# EAGLE schematic WaldoRevd (EAGLE 8.3.2)

## Sheet 1 of 6: Microcontroller Module
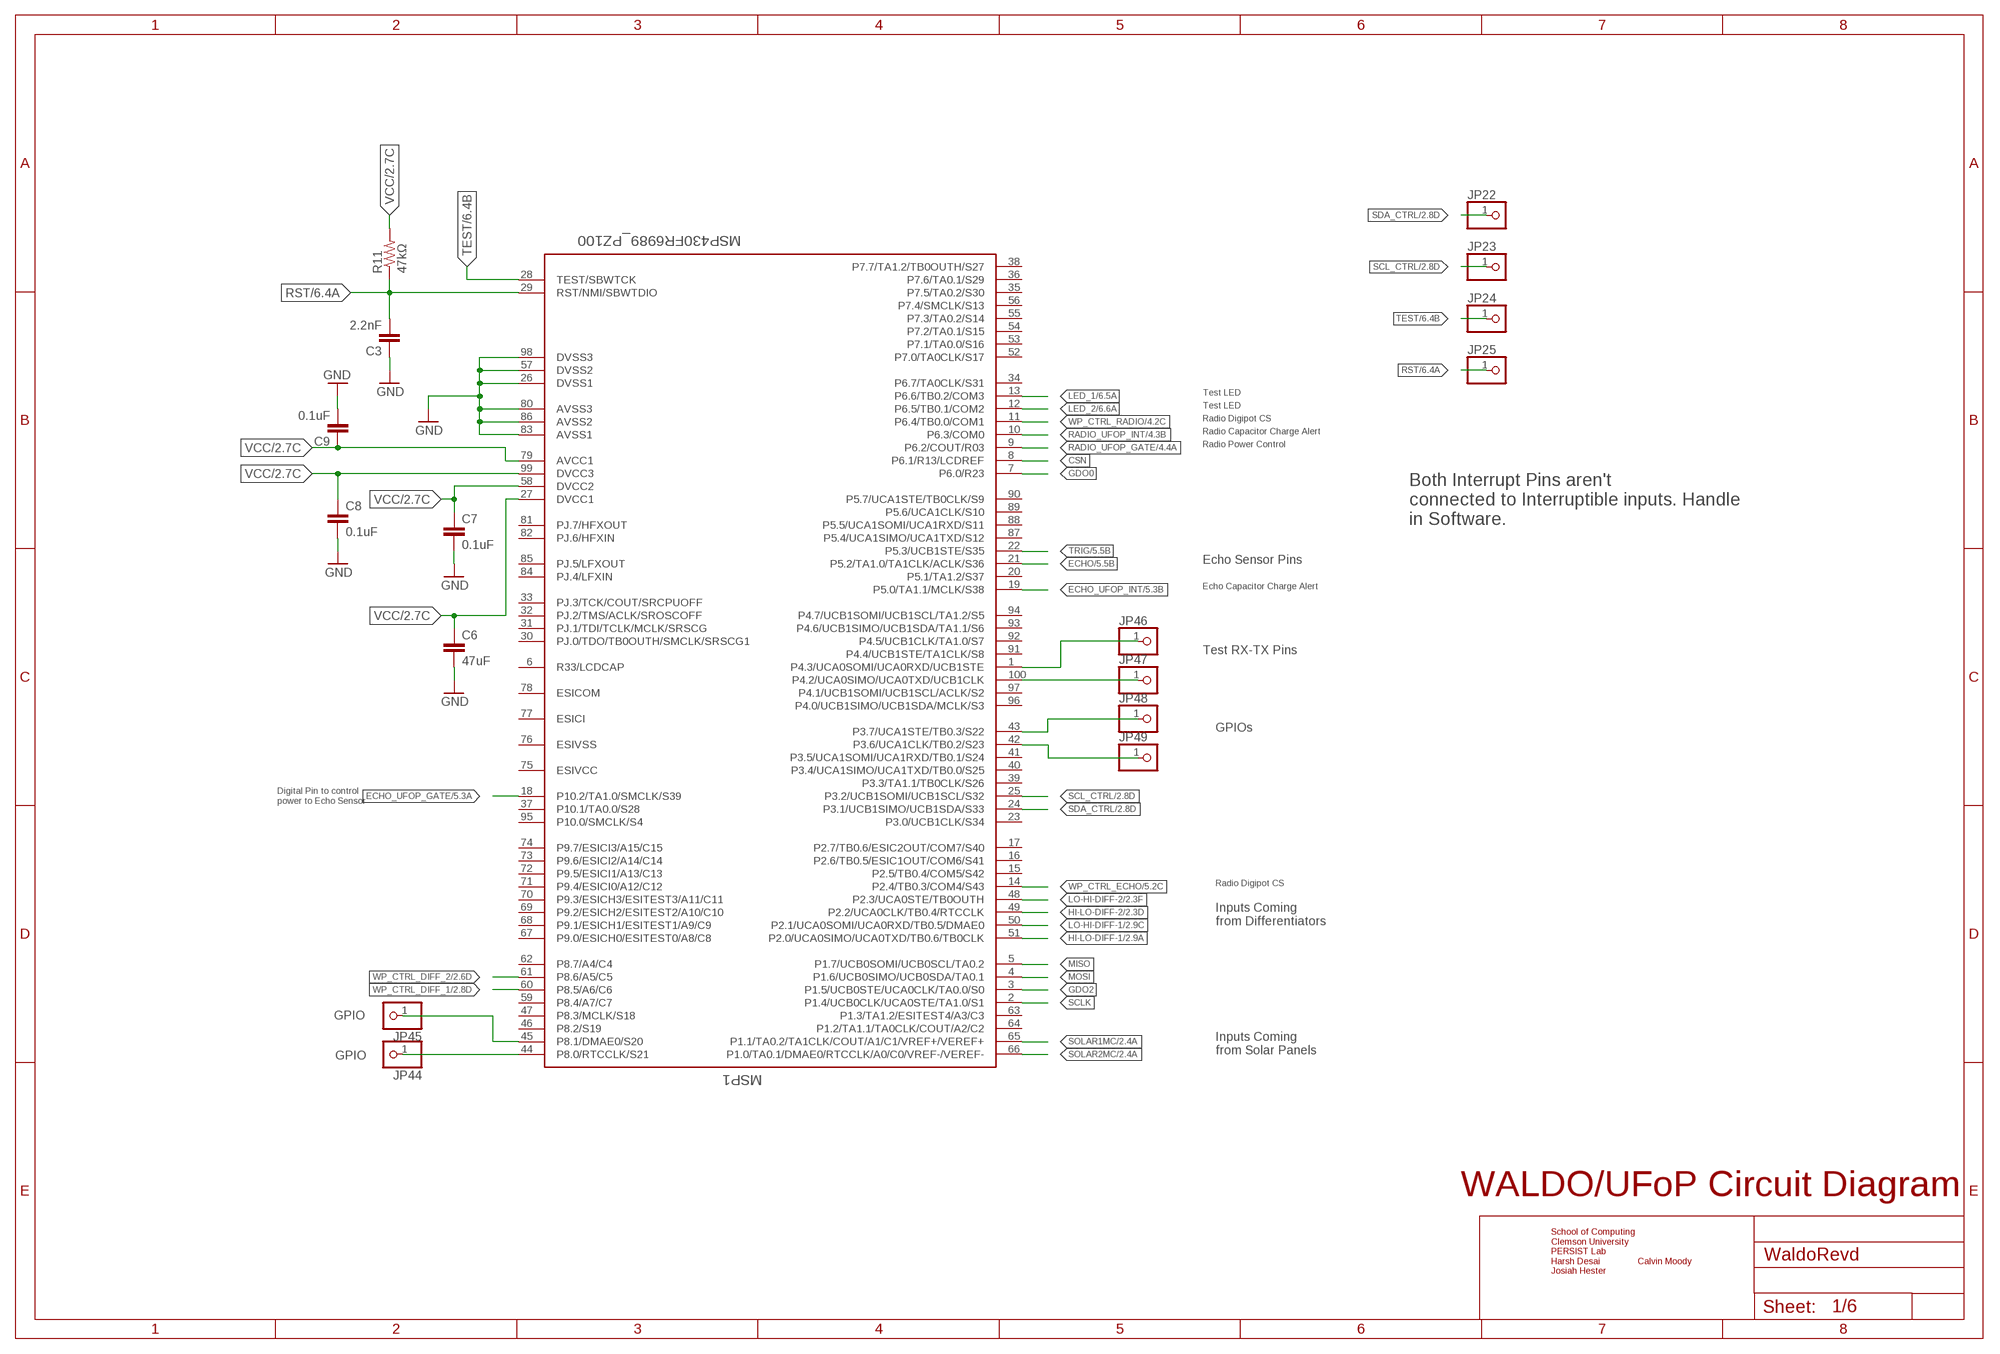
[diagram p0: schematic, sheet 1]

### Parts
C3  2.2nF  CAP0805  [0805]
C6  47uF  CAP0805  [0805]
C7  0.1uF  CAP0805  [0805]
C8  0.1uF  CAP0805  [0805]
C9  0.1uF  CAP0805  [0805]
JP22  PINHD-1X1  [1X01]
JP23  PINHD-1X1  [1X01]
JP24  PINHD-1X1  [1X01]
JP25  PINHD-1X1  [1X01]
JP44  PINHD-1X1  [1X01]
JP45  PINHD-1X1  [1X01]
JP46  PINHD-1X1  [1X01]
JP47  PINHD-1X1  [1X01]
JP48  PINHD-1X1  [1X01]
JP49  PINHD-1X1  [1X01]
MSP1  MSP430FR6989_PZ100  [PZ100]
R11  47kΩ  RESISTOR0805-RES  [0805]

### Nets
CSN: MSP1.8(P6.1/R13/LCDREF) ; also sheet 4
ECHO: MSP1.21(P5.2/TA1.0/TA1CLK/ACLK/S36) ; also sheet 5
ECHO_UFOP_GATE: MSP1.18(P10.2/TA1.0/SMCLK/S39) ; also sheet 5
ECHO_UFOP_INT: MSP1.19(P5.0/TA1.1/MCLK/S38) ; also sheet 5
GDO0: MSP1.7(P6.0/R23) ; also sheet 4
GDO2: MSP1.3(P1.5/UCB0STE/UCA0CLK/TA0.0/S0) ; also sheet 4
GND: C3.1 C6.2 C7.2 C8.2 C9.2 MSP1.26(DVSS1) MSP1.57(DVSS2) MSP1.80(AVSS3) MSP1.83(AVSS1) MSP1.86(AVSS2) MSP1.98(DVSS3) ; also sheet 2,3,4,5,6
HI-LO-DIFF-1: MSP1.51(P2.0/UCA0SIMO/UCA0TXD/TB0.6/TB0CLK) ; also sheet 2
HI-LO-DIFF-2: MSP1.49(P2.2/UCA0CLK/TB0.4/RTCCLK) ; also sheet 2
LED_1: MSP1.13(P6.6/TB0.2/COM3) ; also sheet 6
LED_2: MSP1.12(P6.5/TB0.1/COM2) ; also sheet 6
LO-HI-DIFF-1: MSP1.50(P2.1/UCA0SOMI/UCA0RXD/TB0.5/DMAE0) ; also sheet 2
LO-HI-DIFF-2: MSP1.48(P2.3/UCA0STE/TB0OUTH) ; also sheet 2
MISO: MSP1.5(P1.7/UCB0SOMI/UCB0SCL/TA0.2) ; also sheet 4
MOSI: MSP1.4(P1.6/UCB0SIMO/UCB0SDA/TA0.1) ; also sheet 4
N$1: JP44.1 MSP1.44(P8.0/RTCCLK/S21)
N$2: JP45.1 MSP1.45(P8.1/DMAE0/S20)
N$3: JP46.1 MSP1.1(P4.3/UCA0SOMI/UCA0RXD/UCB1STE)
N$5: JP47.1 MSP1.100(P4.2/UCA0SIMO/UCA0TXD/UCB1CLK)
N$6: JP49.1 MSP1.42(P3.6/UCA1CLK/TB0.2/S23)
N$10: JP48.1 MSP1.43(P3.7/UCA1STE/TB0.3/S22)
RADIO_UFOP_GATE: MSP1.9(P6.2/COUT/R03) ; also sheet 4
RADIO_UFOP_INT: MSP1.10(P6.3/COM0) ; also sheet 4
RST: C3.2 JP25.1 MSP1.29(RST/NMI/SBWTDIO) R11.1 ; also sheet 6
SCL_CTRL: JP23.1 MSP1.25(P3.2/UCB1SOMI/UCB1SCL/S32) ; also sheet 2,4,5,6
SCLK: MSP1.2(P1.4/UCB0CLK/UCA0STE/TA1.0/S1) ; also sheet 4
SDA_CTRL: JP22.1 MSP1.24(P3.1/UCB1SIMO/UCB1SDA/S33) ; also sheet 2,4,5,6
SOLAR1MC: MSP1.65(P1.1/TA0.2/TA1CLK/COUT/A1/C1/VREF+/VEREF+) ; also sheet 2
SOLAR2MC: MSP1.66(P1.0/TA0.1/DMAE0/RTCCLK/A0/C0/VREF-/VEREF-) ; also sheet 2
TEST: JP24.1 MSP1.28(TEST/SBWTCK) ; also sheet 6
TRIG: MSP1.22(P5.3/UCB1STE/S35) ; also sheet 5
VCC: C6.1 C7.1 C8.1 C9.1 MSP1.27(DVCC1) MSP1.58(DVCC2) MSP1.79(AVCC1) MSP1.99(DVCC3) R11.2 ; also sheet 2,3,6
WP_CTRL_DIFF_1: MSP1.60(P8.5/A6/C6) ; also sheet 2
WP_CTRL_DIFF_2: MSP1.61(P8.6/A5/C5) ; also sheet 2
WP_CTRL_ECHO: MSP1.14(P2.4/TB0.3/COM4/S43) ; also sheet 5
WP_CTRL_RADIO: MSP1.11(P6.4/TB0.0/COM1) ; also sheet 4
Unconnected: MSP1.6(R33/LCDCAP) MSP1.15(P2.5/TB0.4/COM5/S42) MSP1.16(P2.6/TB0.5/ESIC1OUT/COM6/S41) MSP1.17(P2.7/TB0.6/ESIC2OUT/COM7/S40) MSP1.20(P5.1/TA1.2/S37) MSP1.23(P3.0/UCB1CLK/S34) MSP1.30(PJ.0/TDO/TB0OUTH/SMCLK/SRSCG1) MSP1.31(PJ.1/TDI/TCLK/MCLK/SRSCG) MSP1.32(PJ.2/TMS/ACLK/SROSCOFF) MSP1.33(PJ.3/TCK/COUT/SRCPUOFF) MSP1.34(P6.7/TA0CLK/S31) MSP1.35(P7.5/TA0.2/S30) MSP1.36(P7.6/TA0.1/S29) MSP1.37(P10.1/TA0.0/S28) MSP1.38(P7.7/TA1.2/TB0OUTH/S27) MSP1.39(P3.3/TA1.1/TB0CLK/S26) MSP1.40(P3.4/UCA1SIMO/UCA1TXD/TB0.0/S25) MSP1.41(P3.5/UCA1SOMI/UCA1RXD/TB0.1/S24) MSP1.46(P8.2/S19) MSP1.47(P8.3/MCLK/S18) MSP1.52(P7.0/TA0CLK/S17) MSP1.53(P7.1/TA0.0/S16) MSP1.54(P7.2/TA0.1/S15) MSP1.55(P7.3/TA0.2/S14) MSP1.56(P7.4/SMCLK/S13) MSP1.59(P8.4/A7/C7) MSP1.62(P8.7/A4/C4) MSP1.63(P1.3/TA1.2/ESITEST4/A3/C3) MSP1.64(P1.2/TA1.1/TA0CLK/COUT/A2/C2) MSP1.67(P9.0/ESICH0/ESITEST0/A8/C8) MSP1.68(P9.1/ESICH1/ESITEST1/A9/C9) MSP1.69(P9.2/ESICH2/ESITEST2/A10/C10) MSP1.70(P9.3/ESICH3/ESITEST3/A11/C11) MSP1.71(P9.4/ESICI0/A12/C12) MSP1.72(P9.5/ESICI1/A13/C13) MSP1.73(P9.6/ESICI2/A14/C14) MSP1.74(P9.7/ESICI3/A15/C15) MSP1.75(ESIVCC) MSP1.76(ESIVSS) MSP1.77(ESICI) MSP1.78(ESICOM) MSP1.81(PJ.7/HFXOUT) MSP1.82(PJ.6/HFXIN) MSP1.84(PJ.4/LFXIN) MSP1.85(PJ.5/LFXOUT) MSP1.87(P5.4/UCA1SIMO/UCA1TXD/S12) MSP1.88(P5.5/UCA1SOMI/UCA1RXD/S11) MSP1.89(P5.6/UCA1CLK/S10) MSP1.90(P5.7/UCA1STE/TB0CLK/S9) MSP1.91(P4.4/UCB1STE/TA1CLK/S8) MSP1.92(P4.5/UCB1CLK/TA1.0/S7) MSP1.93(P4.6/UCB1SIMO/UCB1SDA/TA1.1/S6) MSP1.94(P4.7/UCB1SOMI/UCB1SCL/TA1.2/S5) MSP1.95(P10.0/SMCLK/S4) MSP1.96(P4.0/UCB1SIMO/UCB1SDA/MCLK/S3) MSP1.97(P4.1/UCB1SOMI/UCB1SCL/ACLK/S2)

### Notes on the sheet
- Test LED
- Test LED
- Radio Digipot CS
- Radio Capacitor Charge Alert
- Radio Power Control
- Both Interrupt Pins aren't 
  connected to Interruptible inputs. Handle
  in Software.
- Echo Sensor Pins
- Echo Capacitor Charge Alert
- Test RX-TX Pins
- GPIOs
- Digital Pin to control 
  power to Echo Sensor
- Radio Digipot CS
- Inputs Coming 
  from Differentiators
- GPIO
- Inputs Coming 
  from Solar Panels
- GPIO
- WALDO/UFoP Circuit Diagram
- School of Computing
  Clemson University
  PERSIST Lab
  Harsh Desai               Calvin Moody
  Josiah Hester

## Sheet 2 of 6: Solar Panels + Processing (Differentiators)
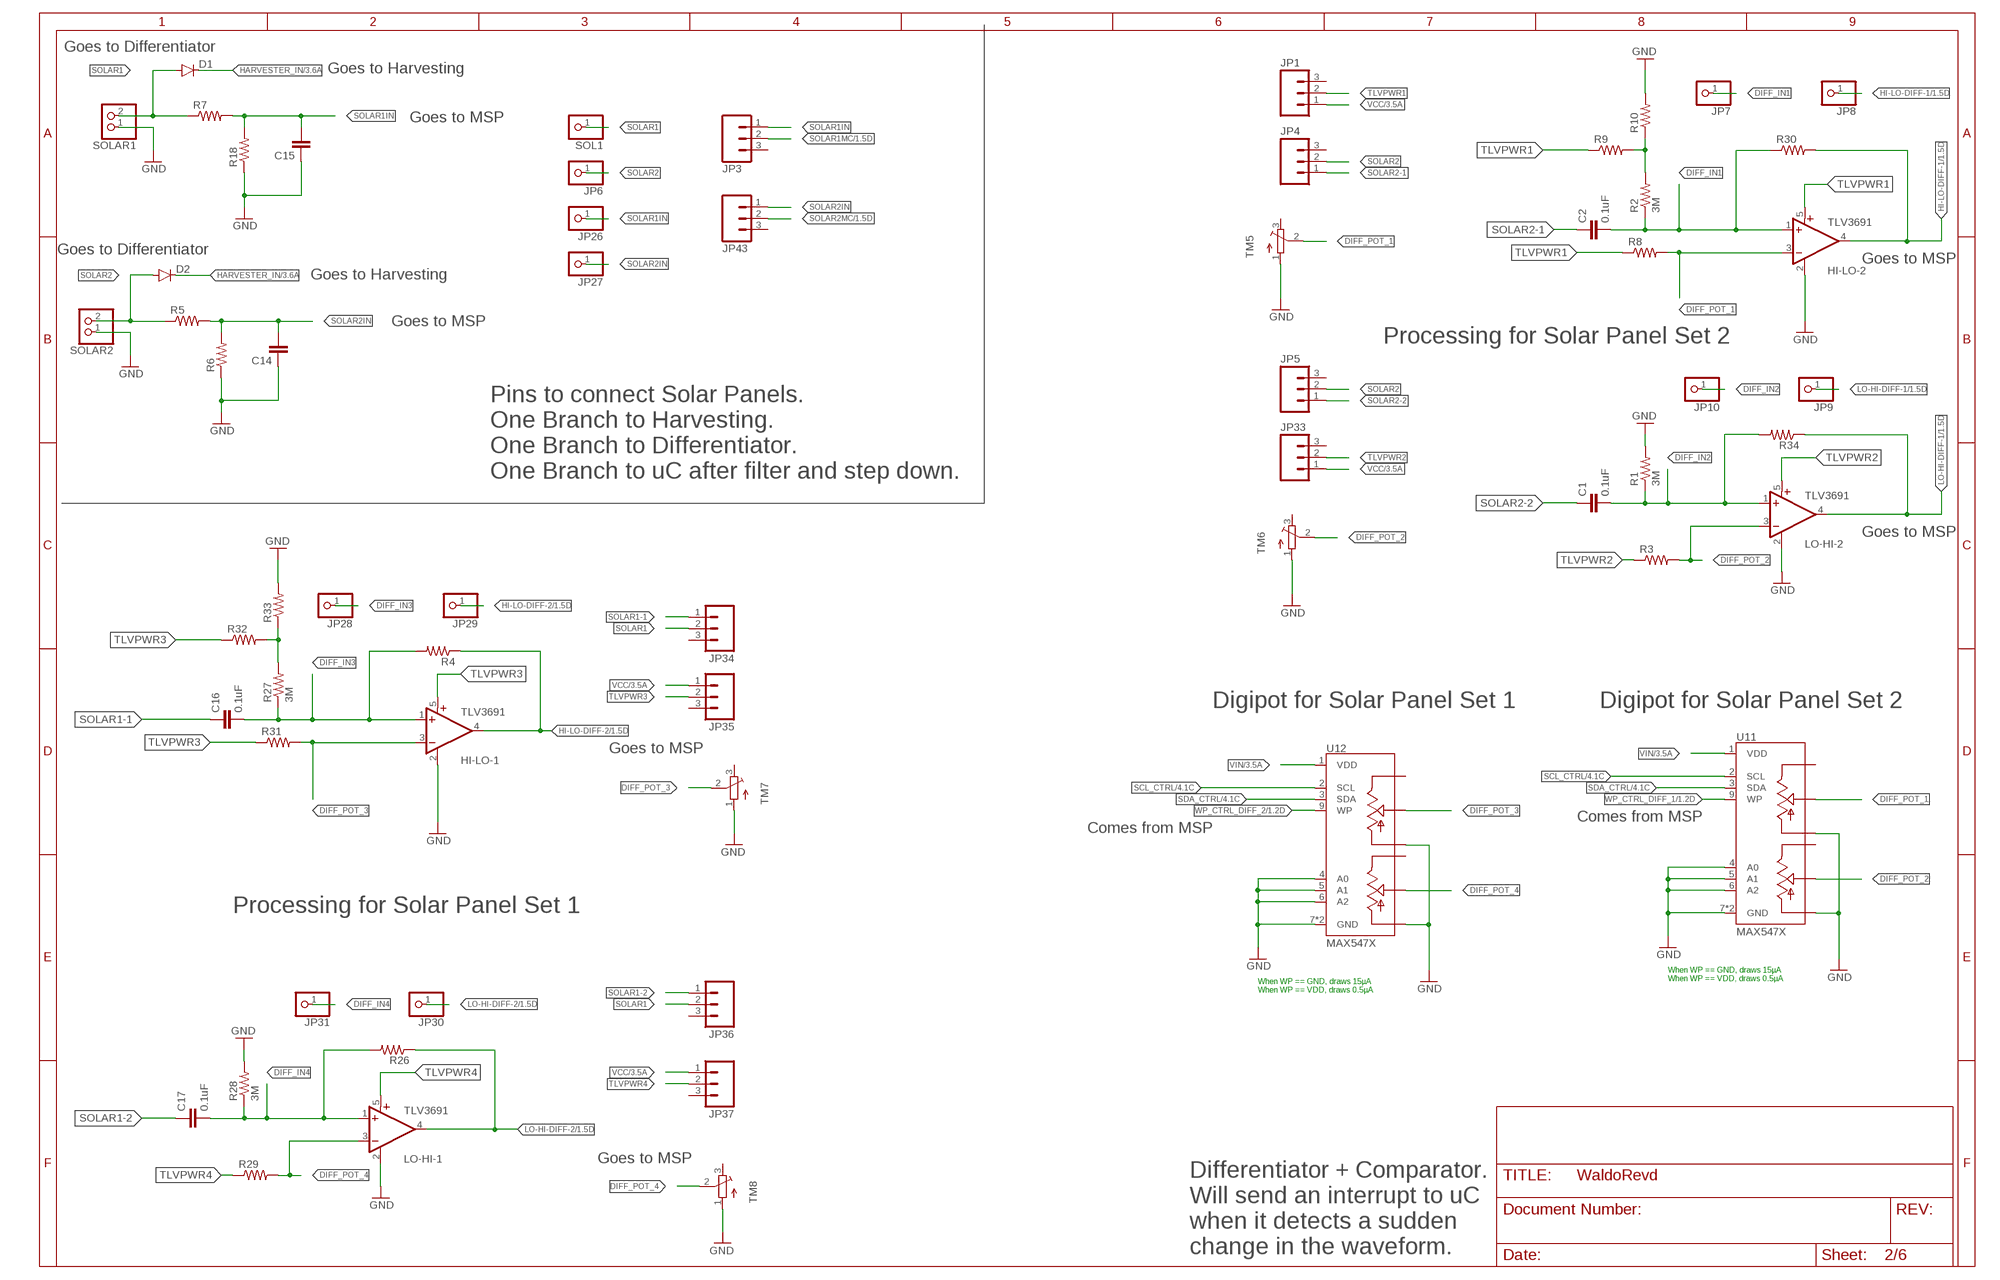
[diagram p1: schematic, sheet 2]

### Parts
C1  0.1uF  CAP0805  [0805]
C2  0.1uF  CAP0805  [0805]
C14  CAP0805  [0805]
C15  CAP0805  [0805]
C16  0.1uF  CAP0805  [0805]
C17  0.1uF  CAP0805  [0805]
D1  DIODESOD523  [SOD523]
D2  DIODESOD523  [SOD523]
HI-LO-1  TLV3691  [SC70-5]
HI-LO-2  TLV3691  [SC70-5]
JP1  M03  [1X03-1.27MM]
JP3  M03  [1X03-1.27MM]
JP4  M03  [1X03-1.27MM]
JP5  M03  [1X03-1.27MM]
JP6  PINHD-1X1  [1X01]
JP7  PINHD-1X1  [1X01]
JP8  PINHD-1X1  [1X01]
JP9  PINHD-1X1  [1X01]
JP10  PINHD-1X1  [1X01]
JP26  PINHD-1X1  [1X01]
JP27  PINHD-1X1  [1X01]
JP28  PINHD-1X1  [1X01]
JP29  PINHD-1X1  [1X01]
JP30  PINHD-1X1  [1X01]
JP31  PINHD-1X1  [1X01]
JP33  M03  [1X03-1.27MM]
JP34  M03  [1X03-1.27MM]
JP35  M03  [1X03-1.27MM]
JP36  M03  [1X03-1.27MM]
JP37  M03  [1X03-1.27MM]
JP43  M03  [1X03-1.27MM]
LO-HI-1  TLV3691  [SC70-5]
LO-HI-2  TLV3691  [SC70-5]
R1  3M  RESISTOR0805-RES  [0805]
R2  3M  RESISTOR0805-RES  [0805]
R3  RESISTOR0805-RES  [0805]
R4  RESISTOR0805-RES  [0805]
R5  RESISTOR0805-RES  [0805]
R6  RESISTOR0805-RES  [0805]
R7  RESISTOR0805-RES  [0805]
R8  RESISTOR0805-RES  [0805]
R9  RESISTOR0805-RES  [0805]
R10  RESISTOR0805-RES  [0805]
R18  RESISTOR0805-RES  [0805]
R26  RESISTOR0805-RES  [0805]
R27  3M  RESISTOR0805-RES  [0805]
R28  3M  RESISTOR0805-RES  [0805]
R29  RESISTOR0805-RES  [0805]
R30  RESISTOR0805-RES  [0805]
R31  RESISTOR0805-RES  [0805]
R32  RESISTOR0805-RES  [0805]
R33  RESISTOR0805-RES  [0805]
R34  RESISTOR0805-RES  [0805]
SOL1  PINHD-1X1  [1X01]
SOLAR1  PINHD-1X2  [1X02]
SOLAR2  PINHD-1X2  [1X02]
TM5  TRIMPOTTC33X  [TC33X]
TM6  TRIMPOTTC33X  [TC33X]
TM7  TRIMPOTTC33X  [TC33X]
TM8  TRIMPOTTC33X  [TC33X]
U11  MAX547X  [QFN16]
U12  MAX547X  [QFN16]

### Nets
DIFF_IN1: C2.2 HI-LO-2.1(+IN) JP7.1 R2.1 R30.1
DIFF_IN2: C1.2 JP10.1 LO-HI-2.1(+IN) R1.1 R34.2
DIFF_IN3: C16.2 HI-LO-1.1(+IN) JP28.1 R4.2 R27.1
DIFF_IN4: C17.2 JP31.1 LO-HI-1.1(+IN) R26.2 R28.1
DIFF_POT_1: HI-LO-2.3(-IN) R8.2 TM5.2(S) U11.14(WA)
DIFF_POT_2: LO-HI-2.3(-IN) R3.2 TM6.2(S) U11.11(WB)
DIFF_POT_3: HI-LO-1.3(-IN) R31.2 TM7.2(S) U12.14(WA)
DIFF_POT_4: LO-HI-1.3(-IN) R29.2 TM8.2(S) U12.11(WB)
GND: C14.1 C15.1 HI-LO-1.2(GND) HI-LO-2.2(GND) LO-HI-1.2(GND) LO-HI-2.2(GND) R1.2 R6.1 R10.2 R18.1 R28.2 R33.2 SOLAR1.1 SOLAR2.1 TM5.1(A) TM6.1(A) TM7.1(A) TM8.1(A) U11.4(A0) U11.5(A1) U11.6(A2) U11.7(GND) U11.10(LB) U11.13(LA) U11.TH(GND) U12.4(A0) U12.5(A1) U12.6(A2) U12.7(GND) U12.10(LB) U12.13(LA) U12.TH(GND) ; also sheet 1,3,4,5,6
HARVESTER_IN: D1.C D2.C ; also sheet 3
HI-LO-DIFF-1: HI-LO-2.4(OUT) JP8.1 R30.2 ; also sheet 1
HI-LO-DIFF-2: HI-LO-1.4(OUT) JP29.1 R4.1 ; also sheet 1
LO-HI-DIFF-1: JP9.1 LO-HI-2.4(OUT) R34.1 ; also sheet 1
LO-HI-DIFF-2: JP30.1 LO-HI-1.4(OUT) R26.1 ; also sheet 1
N$4: R27.2 R32.2 R33.1
N$8: R2.2 R9.2 R10.1
SCL_CTRL: U11.2(SCL) U12.2(SCL) ; also sheet 1,4,5,6
SDA_CTRL: U11.3(SDA) U12.3(SDA) ; also sheet 1,4,5,6
SOLAR1: D1.A JP34.2 JP36.2 R7.1 SOL1.1 SOLAR1.2
SOLAR1-1: C16.1 JP34.1
SOLAR1-2: C17.1 JP36.1
SOLAR1IN: C15.2 JP3.1 JP26.1 R7.2 R18.2
SOLAR1MC: JP3.2 ; also sheet 1
SOLAR2: D2.A JP4.2 JP5.2 JP6.1 R5.1 SOLAR2.2
SOLAR2-1: C2.1 JP4.1
SOLAR2-2: C1.1 JP5.1
SOLAR2IN: C14.2 JP27.1 JP43.1 R5.2 R6.2
SOLAR2MC: JP43.2 ; also sheet 1
TLVPWR1: HI-LO-2.5(V+) JP1.2 R8.1 R9.1
TLVPWR2: JP33.2 LO-HI-2.5(V+) R3.1
TLVPWR3: HI-LO-1.5(V+) JP35.2 R31.1 R32.1
TLVPWR4: JP37.2 LO-HI-1.5(V+) R29.1
VCC: JP1.1 JP33.1 JP35.1 JP37.1 ; also sheet 1,3,6
VIN: U11.1(VDD) U12.1(VDD) ; also sheet 3,4,5,6
WP_CTRL_DIFF_1: U11.9(WP) ; also sheet 1
WP_CTRL_DIFF_2: U12.9(WP) ; also sheet 1
Unconnected: JP1.3 JP3.3 JP4.3 JP5.3 JP33.3 JP34.3 JP35.3 JP36.3 JP37.3 JP43.3 TM5.3(E) TM6.3(E) TM7.3(E) TM8.3(E) U11.12(HB) U11.15(HA) U12.12(HB) U12.15(HA)

### Notes on the sheet
- Goes to Differentiator
- Goes to Harvesting
- Goes to MSP
- Goes to Differentiator
- Goes to MSP
- Goes to Harvesting
- Goes to MSP
- Processing for Solar Panel Set 2
- Pins to connect Solar Panels.
  One Branch to Harvesting.
  One Branch to Differentiator.
  One Branch to uC after filter and step down.
- Goes to MSP
- Digipot for Solar Panel Set 1 | Digipot for Solar Panel Set 2
- Goes to MSP
- Comes from MSP
- Comes from MSP
- Processing for Solar Panel Set 1
- When WP == GND, draws 15µA
  When WP == VDD, draws 0.5µA
- When WP == GND, draws 15µA
  When WP == VDD, draws 0.5µA
- Goes to MSP
- Differentiator + Comparator.
  Will send an interrupt to uC 
  when it detects a sudden 
  change in the waveform.

## Sheet 3 of 6: Battery + Regulator
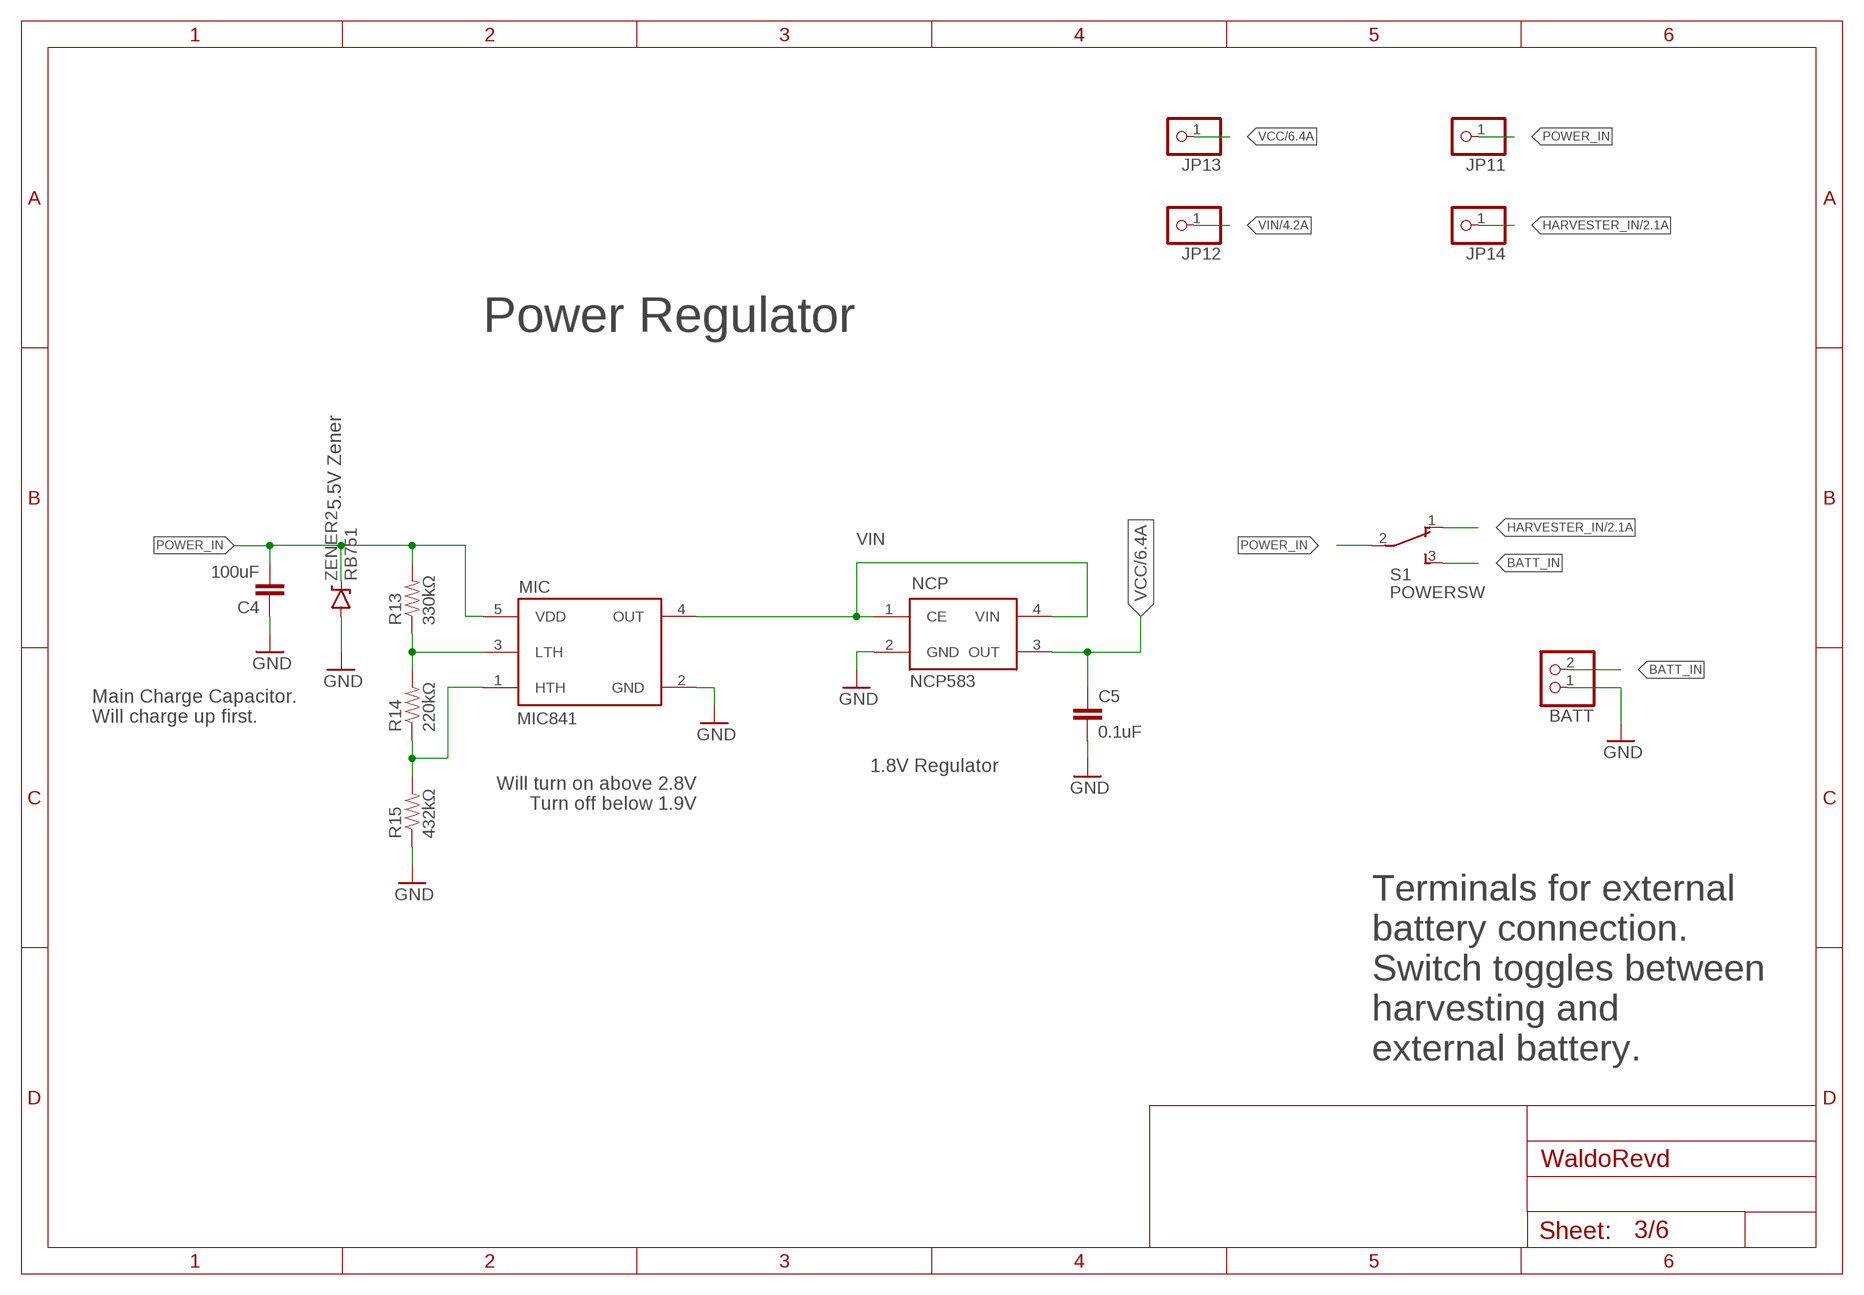
[diagram p2: schematic, sheet 3]

### Parts
BATT  PINHD-1X2  [1X02]
C4  100uF  CAP0805  [0805]
C5  0.1uF  CAP0805  [0805]
JP11  PINHD-1X1  [1X01]
JP12  PINHD-1X1  [1X01]
JP13  PINHD-1X1  [1X01]
JP14  PINHD-1X1  [1X01]
MIC  MIC841  [SC70-5]
NCP  NCP583  [SC82-AB_1PRIMARY]
R13  330kΩ  RESISTOR0805-RES  [0805]
R14  220kΩ  RESISTOR0805-RES  [0805]
R15  432kΩ  RESISTOR0805-RES  [0805]
S1  POWERSW  [TL3XYO]
ZENER2  RB751  DIODE-ZENER  [SOD-523]

### Nets
BATT_IN: BATT.2 S1.3(S)
GND: BATT.1 C4.1 C5.2 MIC.2(GND) NCP.2(GND) R15.1 ZENER2.ANODE(A) ; also sheet 1,2,4,5,6
HARVESTER_IN: JP14.1 S1.1(O) ; also sheet 2
N$11: MIC.3(LTH) R13.1 R14.2
N$12: MIC.1(HTH) R14.1 R15.2
POWER_IN: C4.2 JP11.1 MIC.5(VDD) R13.2 S1.2(P) ZENER2.CATHODE(C)
VCC: C5.1 JP13.1 NCP.3(OUT) ; also sheet 1,2,6
VIN: JP12.1 MIC.4(OUT) NCP.1(CE) NCP.4(VIN) ; also sheet 2,4,5,6

### Notes on the sheet
- Power Regulator
- 5.5V Zener
- Main Charge Capacitor.
  Will charge up first.
- 1.8V Regulator
- Will turn on above 2.8V
  Turn off below 1.9V
- Terminals for external
  battery connection.
  Switch toggles between
  harvesting and 
  external battery.

## Sheet 4 of 6: Radio Module
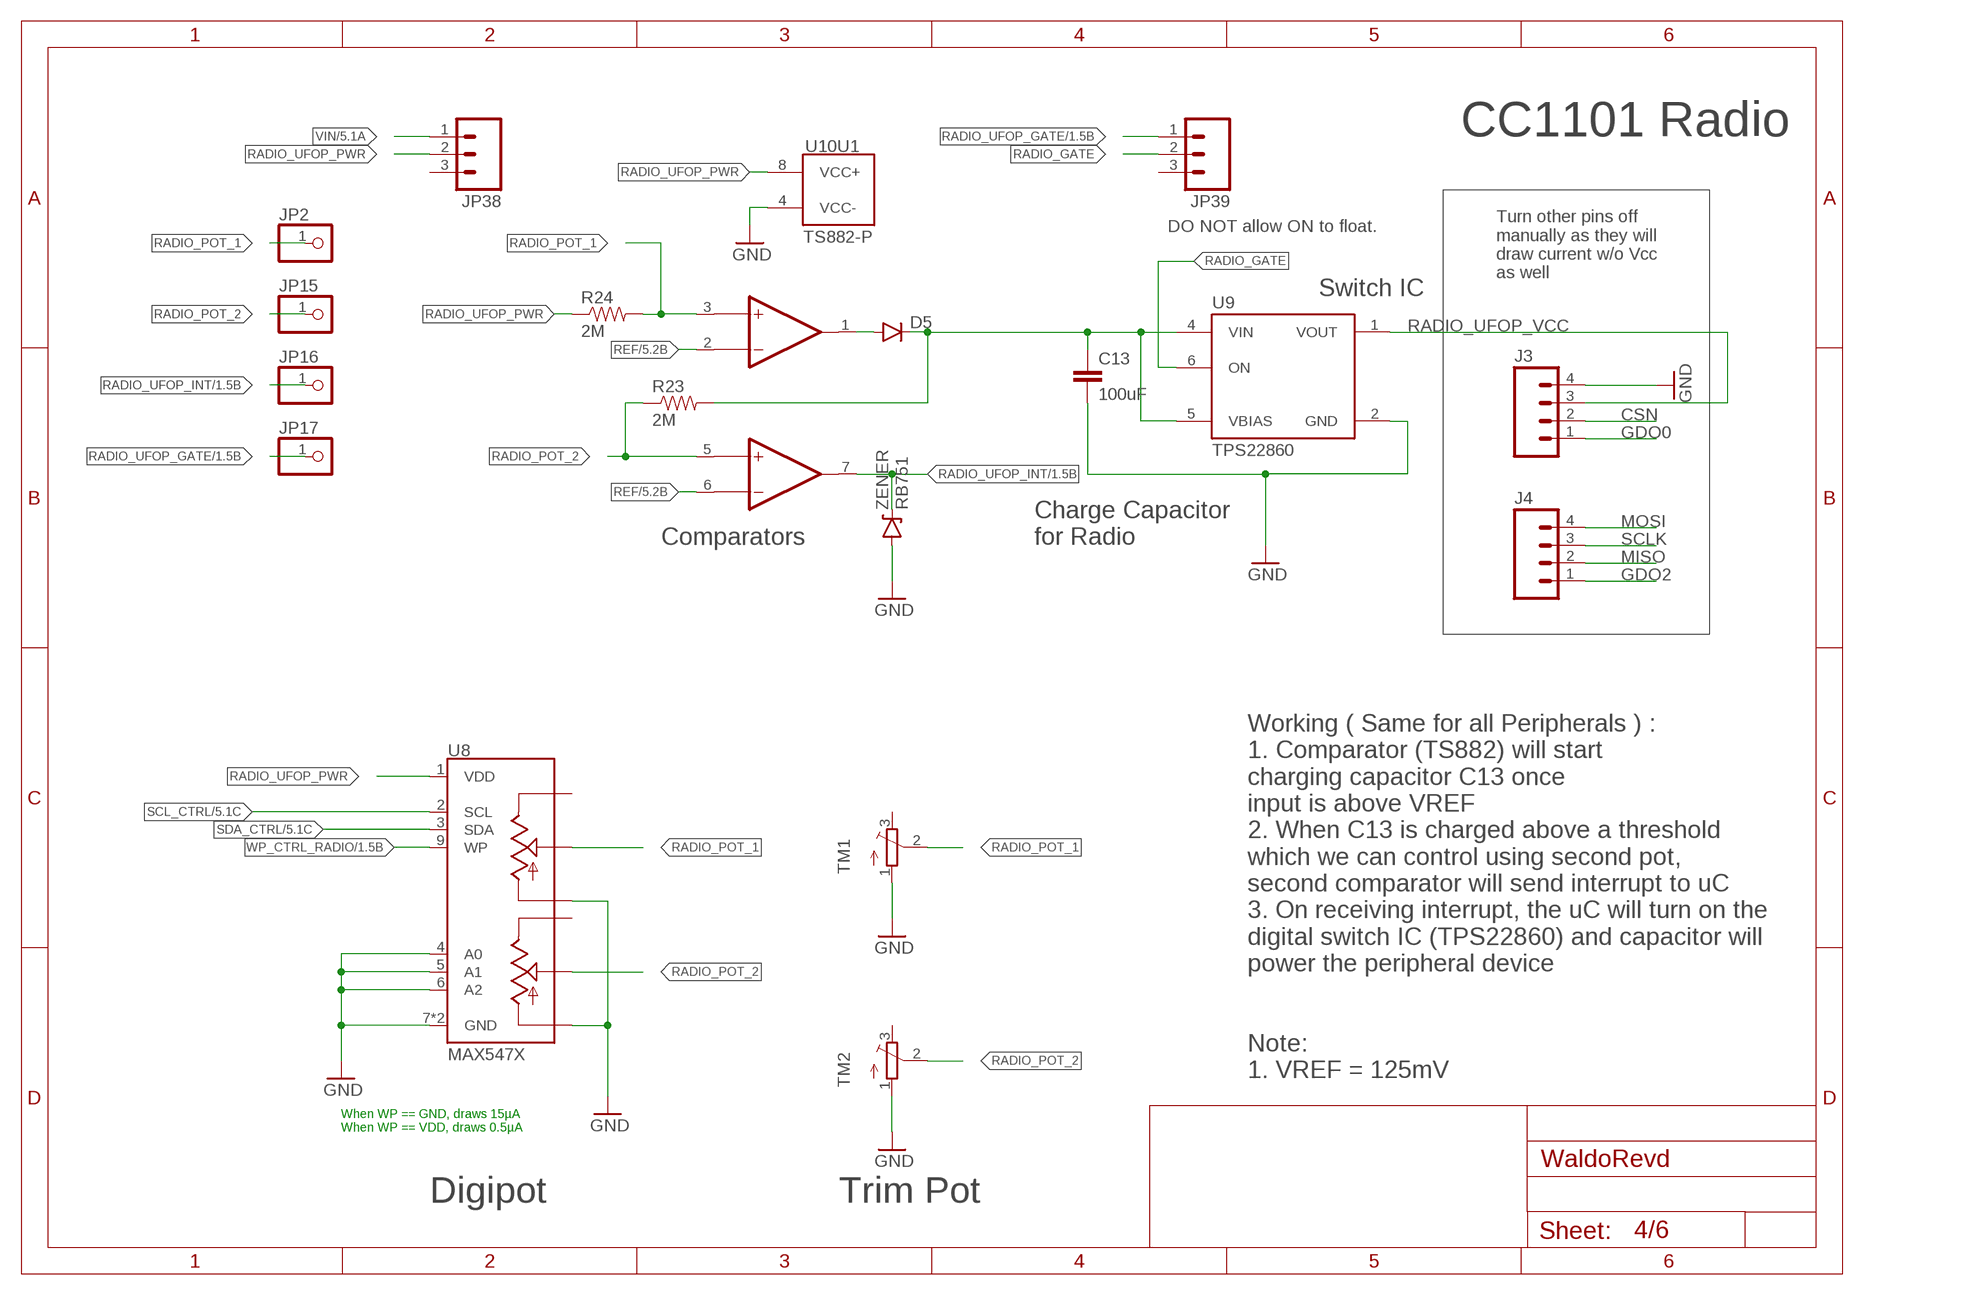
[diagram p3: schematic, sheet 4]

### Parts
C13  100uF  CAP0805  [0805]
D5  DIODESOD523  [SOD523]
J3  M04PTH  [1X04]
J4  M04PTH  [1X04]
JP2  PINHD-1X1  [1X01]
JP15  PINHD-1X1  [1X01]
JP16  PINHD-1X1  [1X01]
JP17  PINHD-1X1  [1X01]
JP38  M03  [1X03-1.27MM]
JP39  M03  [1X03-1.27MM]
R23  2M  RESISTOR0805-RES  [0805]
R24  2M  RESISTOR0805-RES  [0805]
TM1  TRIMPOTTC33X  [TC33X]
TM2  TRIMPOTTC33X  [TC33X]
U8  MAX547X  [QFN16]
U9  TPS22860  [TSOT23-6]
U10  TS882-P  [UDFN8]
ZENER  RB751  DIODE-ZENER  [SOD-523]

### Nets
CSN: J3.2 ; also sheet 1
GDO0: J3.1 ; also sheet 1
GDO2: J4.1 ; also sheet 1
GND: C13.2 J3.4 TM1.1(A) TM2.1(A) U8.4(A0) U8.5(A1) U8.6(A2) U8.7(GND) U8.10(LB) U8.13(LA) U8.TH(GND) U9.2(GND) U10.4(U1:VCC-) ZENER.ANODE(A) ; also sheet 1,2,3,5,6
MISO: J4.2 ; also sheet 1
MOSI: J4.4 ; also sheet 1
N$22: C13.1 D5.C R23.2 U9.4(VIN) U9.5(VBIAS)
N$24: D5.A U10.1(OP1:OUT1)
RADIO_GATE: JP39.2 U9.6(ON)
RADIO_POT_1: JP2.1 R24.2 TM1.2(S) U8.14(WA) U10.3(OP1:IN1+)
RADIO_POT_2: JP15.1 R23.1 TM2.2(S) U8.11(WB) U10.5(OP2:IN1+)
RADIO_UFOP_GATE: JP17.1 JP39.1 ; also sheet 1
RADIO_UFOP_INT: JP16.1 U10.7(OP2:OUT1) ZENER.CATHODE(C) ; also sheet 1
RADIO_UFOP_PWR: JP38.2 R24.1 U8.1(VDD) U10.8(U1:VCC+)
RADIO_UFOP_VCC: J3.3 U9.1(VOUT)
REF: U10.2(OP1:IN1-) U10.6(OP2:IN1-) ; also sheet 5,6
SCL_CTRL: U8.2(SCL) ; also sheet 1,2,5,6
SCLK: J4.3 ; also sheet 1
SDA_CTRL: U8.3(SDA) ; also sheet 1,2,5,6
VIN: JP38.1 ; also sheet 2,3,5,6
WP_CTRL_RADIO: U8.9(WP) ; also sheet 1
Unconnected: JP38.3 JP39.3 TM1.3(E) TM2.3(E) U8.12(HB) U8.15(HA)

### Notes on the sheet
- CC1101 Radio
- DO NOT allow ON to float.
- Turn other pins off 
  manually as they will
  draw current w/o Vcc
  as well
- Switch IC
- Comparators
- Charge Capacitor 
  for Radio
- Working ( Same for all Peripherals ) :
  1. Comparator (TS882) will start 
  charging capacitor C13 once 
  input is above VREF
  2. When C13 is charged above a threshold
  which we can control using second pot, 
  second comparator will send interrupt to uC
  3. On receiving interrupt, the uC will turn on the
  digital switch IC (TPS22860) and capacitor will 
  power the peripheral device
- Note:
  1. VREF = 125mV
- When WP == GND, draws 15µA
  When WP == VDD, draws 0.5µA
- Digipot | Trim Pot

## Sheet 5 of 6: Echo Sensor Module
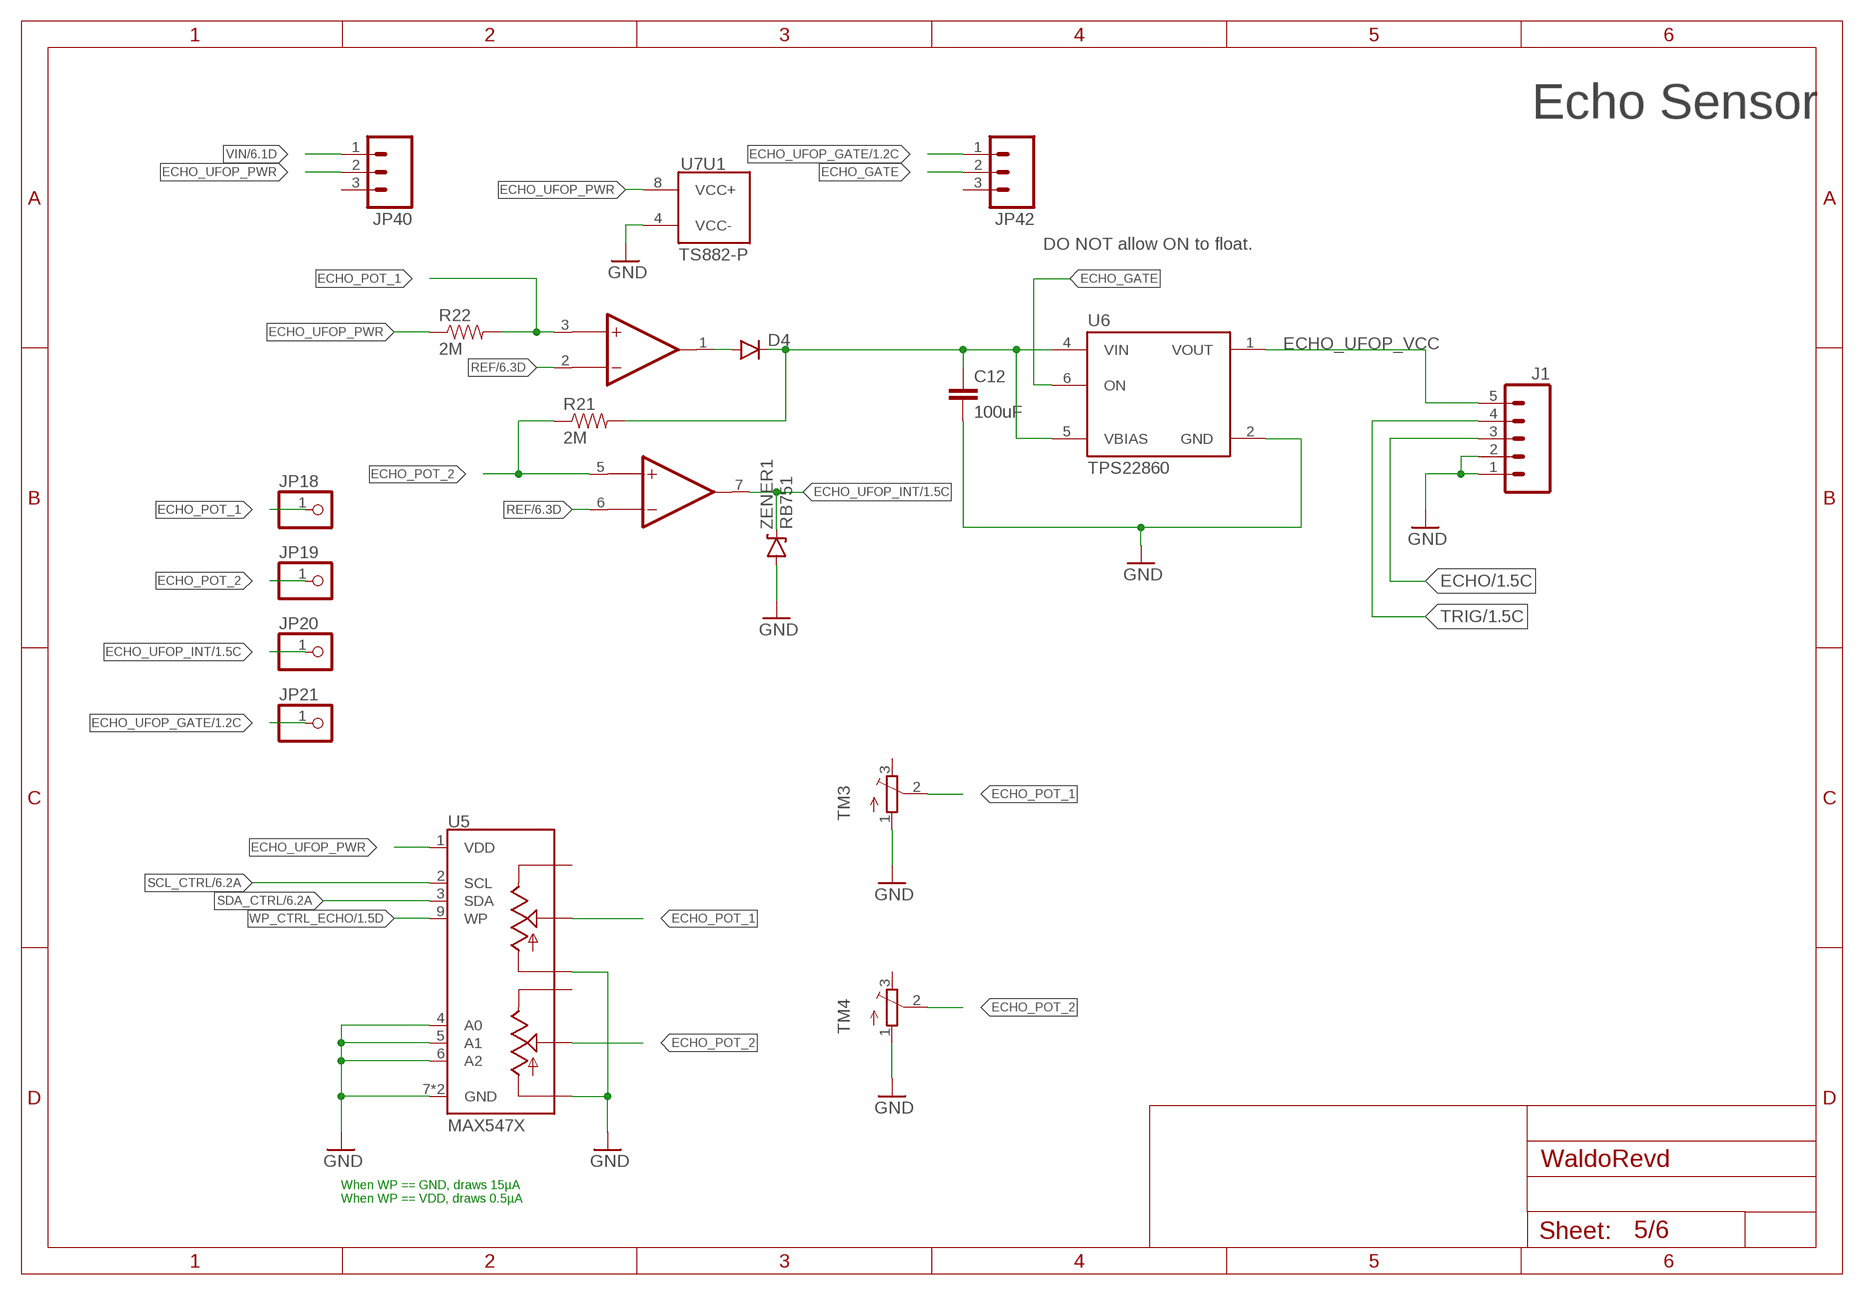
[diagram p4: schematic, sheet 5]

### Parts
C12  100uF  CAP0805  [0805]
D4  DIODESOD523  [SOD523]
J1  M05PTH  [1X05]
JP18  PINHD-1X1  [1X01]
JP19  PINHD-1X1  [1X01]
JP20  PINHD-1X1  [1X01]
JP21  PINHD-1X1  [1X01]
JP40  M03  [1X03-1.27MM]
JP42  M03  [1X03-1.27MM]
R21  2M  RESISTOR0805-RES  [0805]
R22  2M  RESISTOR0805-RES  [0805]
TM3  TRIMPOTTC33X  [TC33X]
TM4  TRIMPOTTC33X  [TC33X]
U5  MAX547X  [QFN16]
U6  TPS22860  [TSOT23-6]
U7  TS882-P  [UDFN8]
ZENER1  RB751  DIODE-ZENER  [SOD-523]

### Nets
ECHO: J1.3 ; also sheet 1
ECHO_GATE: JP42.2 U6.6(ON)
ECHO_POT_1: JP18.1 R22.2 TM3.2(S) U5.14(WA) U7.3(OP1:IN1+)
ECHO_POT_2: JP19.1 R21.1 TM4.2(S) U5.11(WB) U7.5(OP2:IN1+)
ECHO_UFOP_GATE: JP21.1 JP42.1 ; also sheet 1
ECHO_UFOP_INT: JP20.1 U7.7(OP2:OUT1) ZENER1.CATHODE(C) ; also sheet 1
ECHO_UFOP_PWR: JP40.2 R22.1 U5.1(VDD) U7.8(U1:VCC+)
ECHO_UFOP_VCC: J1.5 U6.1(VOUT)
GND: C12.2 J1.1 J1.2 TM3.1(A) TM4.1(A) U5.4(A0) U5.5(A1) U5.6(A2) U5.7(GND) U5.10(LB) U5.13(LA) U5.TH(GND) U6.2(GND) U7.4(U1:VCC-) ZENER1.ANODE(A) ; also sheet 1,2,3,4,6
N$17: C12.1 D4.C R21.2 U6.4(VIN) U6.5(VBIAS)
N$20: D4.A U7.1(OP1:OUT1)
REF: U7.2(OP1:IN1-) U7.6(OP2:IN1-) ; also sheet 4,6
SCL_CTRL: U5.2(SCL) ; also sheet 1,2,4,6
SDA_CTRL: U5.3(SDA) ; also sheet 1,2,4,6
TRIG: J1.4 ; also sheet 1
VIN: JP40.1 ; also sheet 2,3,4,6
WP_CTRL_ECHO: U5.9(WP) ; also sheet 1
Unconnected: JP40.3 JP42.3 TM3.3(E) TM4.3(E) U5.12(HB) U5.15(HA)

### Notes on the sheet
- Echo Sensor
- DO NOT allow ON to float.
- When WP == GND, draws 15µA
  When WP == VDD, draws 0.5µA

## Sheet 6 of 6: Programmer, RTC, Misc
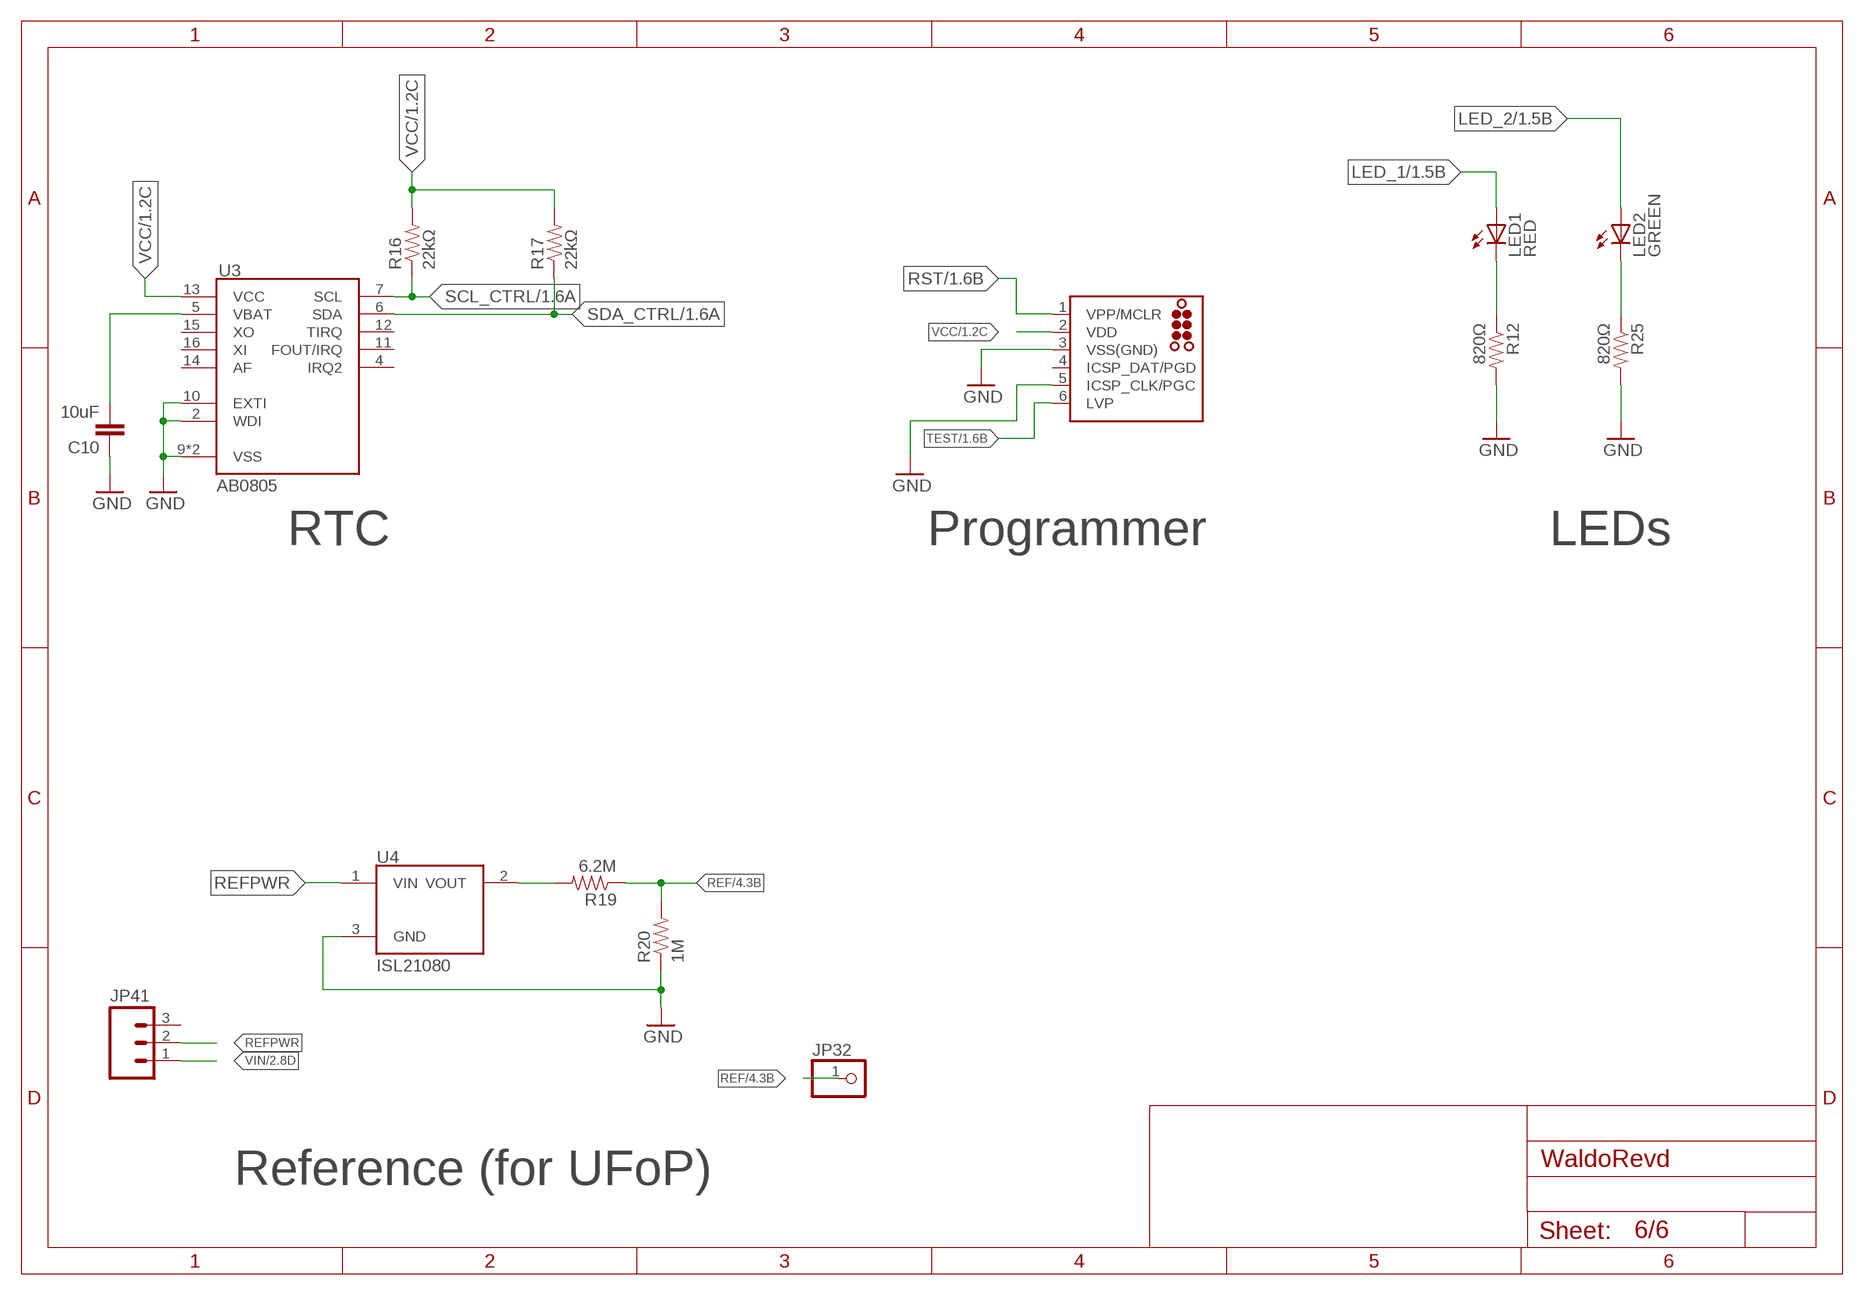
[diagram p5: schematic, sheet 6]

### Parts
C10  10uF  CAP0805  [0805]
J2  TC2030-MCP-NL  [TC2030-MCP-NL]
JP32  PINHD-1X1  [1X01]
JP41  M03  [1X03-1.27MM]
LED1  RED  LEDCHIP-LED0805  [CHIP-LED0805]
LED2  GREEN  LEDCHIP-LED0805  [CHIP-LED0805]
R12  820Ω  RESISTOR0805-RES  [0805]
R16  22kΩ  RESISTOR0805-RES  [0805]
R17  22kΩ  RESISTOR0805-RES  [0805]
R19  6.2M  RESISTOR0805-RES  [0805]
R20  1M  RESISTOR0805-RES  [0805]
R25  820Ω  RESISTOR0805-RES  [0805]
U3  AB0805  [QFN16]
U4  ISL21080  [SOT-23]

### Nets
GND: C10.1 J2.3(VSS(GND)) J2.5(ICSP_CLK/PGC) R12.2 R20.1 R25.2 U3.2(WDI) U3.9(VSS) U3.10(EXTI) U3.TH(VSS) U4.3(GND) ; also sheet 1,2,3,4,5
LED_1: LED1.A ; also sheet 1
LED_2: LED2.A ; also sheet 1
N$7: LED1.C R12.1
N$9: LED2.C R25.1
N$13: C10.2 U3.5(VBAT)
N$14: R19.2 U4.2(VOUT)
REF: JP32.1 R19.1 R20.2 ; also sheet 4,5
REFPWR: JP41.2 U4.1(VIN)
RST: J2.1(VPP/MCLR) ; also sheet 1
SCL_CTRL: R16.1 U3.7(SCL) ; also sheet 1,2,4,5
SDA_CTRL: R17.1 U3.6(SDA) ; also sheet 1,2,4,5
TEST: J2.6(LVP) ; also sheet 1
VCC: J2.2(VDD) R16.2 R17.2 U3.13(VCC) ; also sheet 1,2,3
VIN: JP41.1 ; also sheet 2,3,4,5
Unconnected: J2.4(ICSP_DAT/PGD) JP41.3 U3.4(IRQ2) U3.11(FOUT/IRQ) U3.12(TIRQ) U3.14(AF) U3.15(XO) U3.16(XI)

### Notes on the sheet
- RTC | Programmer | LEDs
- Reference (for UFoP)

## Library data of the parts
BATT SOLAR1 SOLAR2 = pinhead:PINHD-1X2: PIN HEADER
C1-C10 C14-C17 = SparkFun-Capacitors:CAP: Capacitor Standard 0603 ceramic capacitor, and 0.1" leaded capacitor.
C12 C13 = SparkFun-Capacitors:CAP: Capacitor Standard 0603 ceramic capacitor, and 0.1" leaded capacitor.; DIGIKEY: 490-9969-1-ND
D1 D2 D4 D5 = SparkFun-DiscreteSemi:DIODE: Diode These are standard reverse protection diodes and small signal diodes. SMA package can handle up to about 1A. SOD-323 can handle about 200mA. What the SOD-323 package when ordering, there are some mfgs out there that are 5-pin packages.
HI-LO-1 HI-LO-2 LO-HI-1 LO-HI-2 = fedpower:TLV3691: 0.9-V to 6.5-V, Nanopower Comparator Datasheets Analog Signal Chain Guide <http://www.ti.com/lit/pdf/slyb174> TLV3691 <http://www.ti.com/lit/ds/symlink/tlv3691.pdf> Manufacturer Product Page TLV3691IDPFR Specifications <http://www.ti.com/general/docs/suppproductinfo.tsp?distId=10&orderablePartNumber=TLV3691IDPFR> Standard Package <javascript:dlgHelp('Standard%20Packaging%20Help');> 1 Category Integrated Circuits (ICs) </product-search/en/integrated-circuits-ics> Family Linear - Comparators </product-search/en/integrated-circuits-ics/linear-comparators/2556221> Series - Packaging <javascript:dlgHelp('Standard%20Packaging%20Help');> Cut Tape (CT) <javascript:dlgHelp('Cut%20Tape%20Help');> Type General Purpose Number of Elements 1 Output Type Push-Pull Voltage - Supply, Single/Dual (±) 0.9 V ~ 6.5 V, ±0.45 V ~ 3.25 V Voltage - Input Offset (Max) 3mV Current - Input Bias (Max) 100pA Current - Output (Typ) 42mA Current - Quiescent (Max) 150nA CMRR, PSRR (Typ) - Propagation Delay (Max) 35µs Hysteresis - Operating Temperature -40°C ~ 125°C Package / Case 6-XFDFN Mounting Type Surface Mount Supplier Device Package 6-X2SON (1x1) Online Catalog Comparators - 1 element </catalog/en/partgroup/comparators-1-element/3112?mpart=TLV3691IDPFR&vendor=296&WT.z_ref_page_type=PS&WT.z_ref_page_sub_type=PD&WT.z_ref_page_id=PD&WT.z_ref_page_event=DC_Link_Table> Other Names 296-37242-1
J1 = SparkFun-Connectors:M05: Header 5 Standard 5-pin 0.1" header. Use with straight break away headers (SKU : PRT-00116), right angle break away headers (PRT-00553), swiss pins (PRT-00743), machine pins (PRT-00117), and female headers (PRT-00115). Molex polarized connector foot print use with SKU : PRT-08230 with associated crimp pins and housings.
J2 = tag-connect_msp430:TC2030: TAG-CONNECT ICSP Connector Manufacturer: Tag-Connect <http://www.tag-connect.com> Cable for easy In-Circuit Serial Programming. Designed for Microchip ICD2, suitable for many others. Two variants - one "with legs" (for hands-free fit on PCB) and another "without legs" for quick programming. PAD Description 1 MCLR/Vpp 2 Vdd 3 GND 4 PGD (ISPDAT) 5 PGC (ISPCLK) 6 nc (used for LVP) ©2009 ROFA.cz - modified and updated by Robert Darlington ‹rdarlington@gmail.com›
J3 J4 = SparkFun-Connectors:M04: Header 4 Standard 4-pin 0.1" header. Use with straight break away headers (SKU : PRT-00116), right angle break away headers (PRT-00553), swiss pins (PRT-00743), machine pins (PRT-00117), and female headers (PRT-00115). Molex polarized connector foot print use with SKU : PRT-08231 with associated crimp pins and housings. 1MM SMD Version SKU: PRT-10208; PROD_ID: CONN-09696
JP1 JP3-JP5 JP33-JP43 = SparkFun-Connectors:M03: Header 3 Standard 3-pin 0.1" header. Use with straight break away headers (SKU : PRT-00116), right angle break away headers (PRT-00553), swiss pins (PRT-00743), machine pins (PRT-00117), and female headers (PRT-00115). Molex polarized connector foot print use with SKU : PRT-08232 with associated crimp pins and housings.
JP2 JP6-JP32 JP44-JP49 SOL1 = adafruit:PINHD-1X1: Pin header 1x1 for 0.1" spacing With round pins
LED1 LED2 = led:LED: LED OSRAM: - CHIPLED LG R971, LG N971, LY N971, LG Q971, LY Q971, LO R971, LY R971 LH N974, LH R974 LS Q976, LO Q976, LY Q976 LO Q996 - Hyper CHIPLED LW Q18S LB Q993, LB Q99A, LB R99A - SideLED LS A670, LO A670, LY A670, LG A670, LP A670 LB A673, LV A673, LT A673, LW A673 LH A674 LY A675 LS A676, LA A676, LO A676, LY A676, LW A676 LS A679, LY A679, LG A679 - Hyper Micro SIDELED® LS Y876, LA Y876, LO Y876, LY Y876 LT Y87S - SmartLED LW L88C, LW L88S LB L89C, LB L89S, LG L890 LS L89K, LO L89K, LY L89K LS L896, LA L896, LO L896, LY L896 - TOPLED LS T670, LO T670, LY T670, LG T670, LP T670 LSG T670, LSP T670, LSY T670, LOP T670, LYG T670 LG T671, LOG T671, LSG T671 LB T673, LV T673, LT T673, LW T673 LH T674 LS T676, LA T676, LO T676, LY T676, LB T676, LH T676, LSB T676, LW T676 LB T67C, LV T67C, LT T67C, LS T67K, LO T67K, LY T67K, LW E67C LS E67B, LA E67B, LO E67B, LY E67B, LB E67C, LV E67C, LT E67C LW T67C LS T679, LY T679, LG T679 LS T770, LO T770, LY T770, LG T770, LP T770 LB T773, LV T773, LT T773, LW T773 LH T774 LS E675, LA E675, LY E675, LS T675 LS T776, LA T776, LO T776, LY T776, LB T776 LHGB T686 LT T68C, LB T68C - Hyper Mini TOPLED® LB M676 - Mini TOPLED Santana® LG M470 LS M47K, LO M47K, LY M47K Source: http://www.osram.convergy.de LUXEON: - LUMILED® LXK2-PW12-R00, LXK2-PW12-S00, LXK2-PW14-U00, LXK2-PW14-V00 LXK2-PM12-R00, LXK2-PM12-S00, LXK2-PM14-U00 LXK2-PE12-Q00, LXK2-PE12-R00, LXK2-PE12-S00, LXK2-PE14-T00, LXK2-PE14-U00 LXK2-PB12-K00, LXK2-PB12-L00, LXK2-PB12-M00, LXK2-PB14-N00, LXK2-PB14-P00, LXK2-PB14-Q00 LXK2-PR12-L00, LXK2-PR12-M00, LXK2-PR14-Q00, LXK2-PR14-R00 LXK2-PD12-Q00, LXK2-PD12-R00, LXK2-PD12-S00 LXK2-PH12-R00, LXK2-PH12-S00 LXK2-PL12-P00, LXK2-PL12-Q00, LXK2-PL12-R00 Source: www.luxeon.com KINGBRIGHT: KA-3528ASYC Source: www.kingbright.com
MIC = mic841:MIC841: MIC841:Comparator with reference and adj. hysteresis
MSP1 = msp430:MSP430FR6989_PZ100
NCP = ncp583:NCP583: NCP583 - Ultra-Low Iq 150 mA CMOS LDO Regulator with Enable The NCP583 series of low dropout regulators are designed for portable battery powered applications which require precise output voltage accuracy and low quiescent current. These devices feature an enable function which lowers current consumption significantly and are offered in two small packages; SC−82AB and the SOT−563. A 1.0 mF ceramic capacitor is the recommended value to be used with these devices on the output pin.
R1-R18 R22 R24-R34 = SparkFun-Resistors:RESISTOR: Resistor Basic schematic elements and footprints for 0603, 1206, and PTH resistors.
R19 = SparkFun-Resistors:RESISTOR: Resistor Basic schematic elements and footprints for 0603, 1206, and PTH resistors.; DIGIKEY: 541-6.20MHCT-ND
R20 = SparkFun-Resistors:RESISTOR: Resistor Basic schematic elements and footprints for 0603, 1206, and PTH resistors.; DIGIKEY: 311-1.00MHRCT-ND
R21 R23 = SparkFun-Resistors:RESISTOR: Resistor Basic schematic elements and footprints for 0603, 1206, and PTH resistors.; DIGIKEY: 311-2.00MHRCT-ND
S1 = GreenBoard:POWERSW: TINY SWITCH ON - ON Source: http://www2.produktinfo.conrad.com/datenblaetter/700000-724999/705152-da-01-de-Subminiaturschalter_TL_36YO.pdf
TM1-TM8 = adafruit:TRIMPOT: SMT trimmer potentiometer part number TC33X http://www.ladyada.net/library/eagle
U3 = AB08XX:AB0805: AB08X5 Real-Time Clock Family: I2C Version The ABRACON AB08X5 Real-Time Clock family provides a groundbreaking combination of ultra-low power coupled with a highly sophisticated feature set. With power requirements significantly lower than any other industry RTC (as low as 14 nA), these are the first semiconductors based on innovative SPOTTM (Subthreshold Power Optimized Technology) CMOS platform. The AB08X5 includes on-chip oscillators to provide minimum power consumption, full RTC functions including battery backup and programmable counters and alarms for timer and watchdog functions, and either an I2C or SPI serial interface for communication with a host controller.; MOUSER: 815-AB0805-T3
U4 = isl21080:ISL21080: Intersil: ISL21080, 300nA NanoPower Voltage References The ISL21080 analog voltage references feature low supply voltage operation at ultra-low 310nA typ, 1.5µA max operating current. Additionally, the ISL21080 family features guaranteed initial accuracy as low as ±0.2% and 50ppm/°C temperature coefficient. These references are ideal for general purpose portable applications to extend battery life at lower cost. The ISL21080 is provided in the industry standard 3 Ld SOT-23 pinout. The ISL21080 output voltages can be used as precision voltage sources for voltage monitors, control loops, standby voltages for low power states for DSP, FPGA, Datapath Controllers, microcontrollers and other core voltages: 0.9V, 1.024V, 1.25V, 1.5V, 2.048V, 2.5V, 3.0V, 3.3V, 4.096V and 5.0V. Special Note: Post-assembly x-ray inspection may lead to permanent changes in device output voltage and should be minimized or avoided. For further information, please see “Applications Information” on page 14 and AN1533, “X-Ray Effects on Intersil FGA References”.; DIGIKEY: ISL21080DIH309Z-TKCT-ND
U5 U8 U11 U12 = max547x:MAX547X: MAXIM MAX547X: Dual, 256-Tap, Nonvolatile, I2C-Interface, Digital Potentiometers, 400nA Iq, 250µA 12ms write The MAX5477/MAX5478/MAX5479 nonvolatile, dual, linear-taper, digital potentiometers perform the function of a mechanical potentiometer, but replace the mechanics with a simple 2-wire digital interface. Each device performs the same function as a discrete potentiometer or variable resistor and has 256 tap points. The devices feature an internal, nonvolatile EEPROM used to store the wiper position for initialization during power-up. A write-protect feature prevents accidental overwrites of the EEPROM. The fast-mode I2C-compatible serial interface allows communication at data rates up to 400kbps, minimizing board space and reducing interconnection complexity in many applications. Three address inputs allow a total of eight unique address combinations.; DIGIKEY: MAX5479ETE+-ND
U6 U9 = tps22860:TPS22860: TI: TPS22860 Ultra-Low Leakage Load Switch The TPS22860 is a small, ultra-low leakage current, single channel load switch. The device requires a VBIAS voltage and can operate over an input voltage range of 0 V to VBIAS. It can support a maximum continuous current of 200 mA. The switch is controlled by an on/off input (ON), which is capable of interfacing directly with low-voltage control signals. The TPS22860 is available in two small, space-saving 6-pin SOT-23 and SC70 packages. The device is characterized for operation over the free-air temperature range of –40°C to 85°C.; DIGIKEY: 296-43982-1-ND
U7 U10 = ts882:TS882-P; DIGIKEY: 497-14073-1-ND
ZENER ZENER1 ZENER2 = Parts:DIODE-ZENER: Zener Diode Production Part - 8199 3.4V Zener Voltage